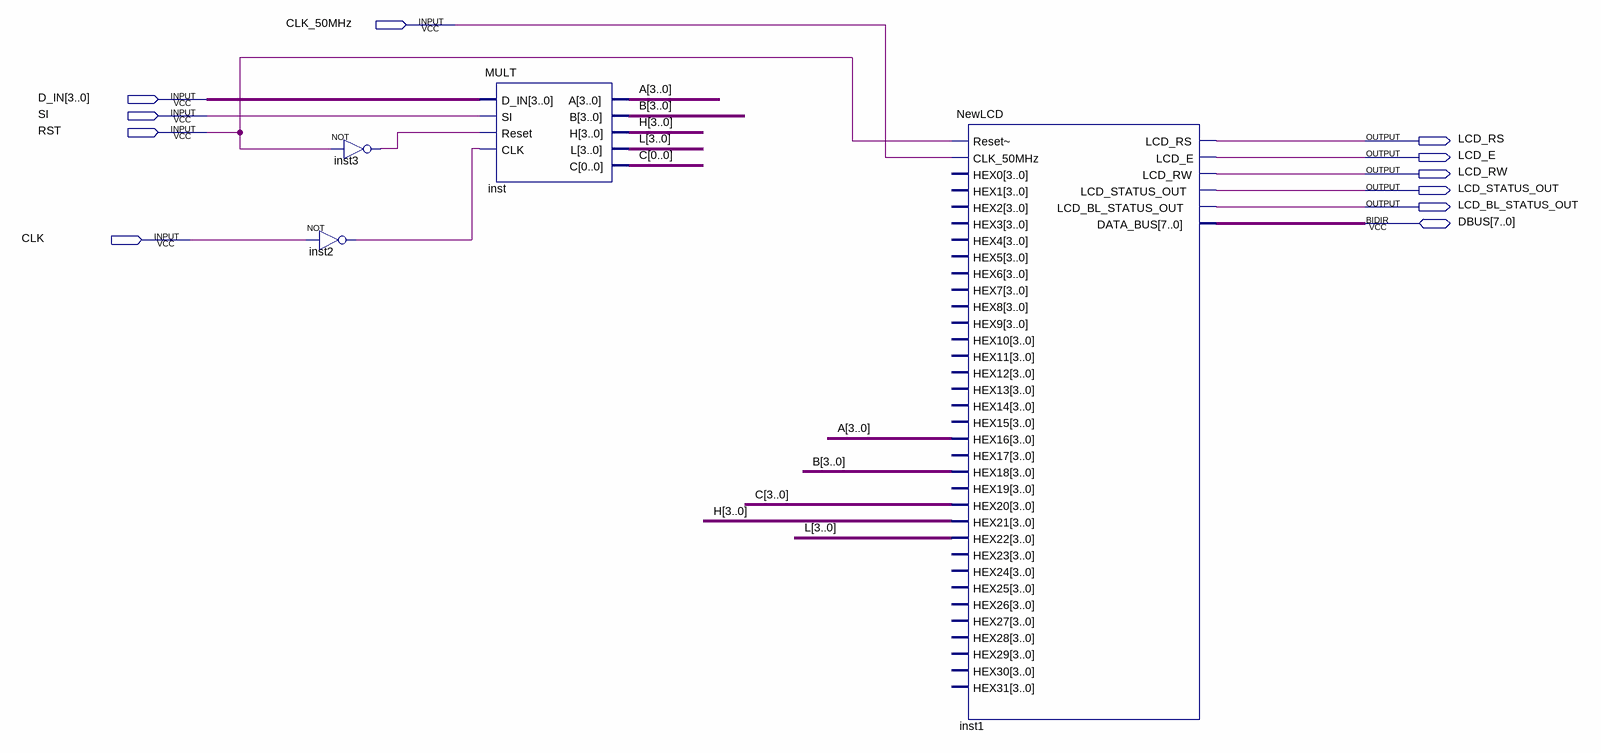
[diagram p0: schematic sheet]
// Quartus schematic MULT212251543.bdf as structural Verilog: 4 symbols, 11 pins
module MULT212251543 (
  input  CLK_50MHz,
  input  [3:0] D_IN,
  input  SI,
  input  RST,
  input  CLK,
  inout  [7:0] DBUS,
  output LCD_RS,
  output LCD_E,
  output LCD_RW,
  output LCD_STATUS_OUT,
  output LCD_BL_STATUS_OUT
);

  wire inst2_out, inst3_out;
  wire [3:0] A, B, C, H, L;

  not inst2 (inst2_out, CLK);
  not inst3 (inst3_out, RST);
  MULT inst (.D_IN(D_IN), .SI(SI), .Reset(inst3_out), .CLK(inst2_out), .A(A), .B(B), .H(H), .L(L), .C(C[0]));
  NewLCD inst1 (
    .\Reset~ (RST), .CLK_50MHz(CLK_50MHz), .HEX16(A), .HEX18(B), .HEX20(C), .HEX21(H), .HEX22(L),
    .LCD_RS(LCD_RS), .LCD_E(LCD_E), .LCD_RW(LCD_RW), .LCD_STATUS_OUT(LCD_STATUS_OUT),
    .LCD_BL_STATUS_OUT(LCD_BL_STATUS_OUT), .DATA_BUS(DBUS));  // open: HEX0, HEX1, HEX2, HEX3, HEX4, HEX5, HEX6, HEX7, HEX8, HEX9, HEX10, HEX11, HEX12, HEX13, HEX14, HEX15, HEX17, HEX19, HEX23, HEX24, HEX25, HEX26, HEX27, HEX28, HEX29, HEX30, HEX31
endmodule
